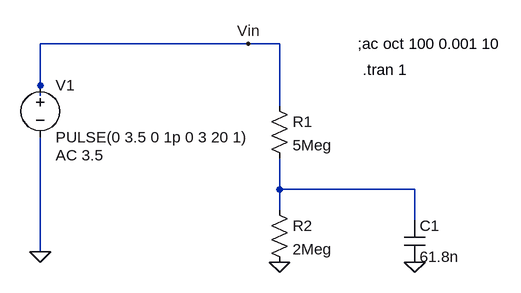
[diagram p0: schematic WeatherStationAnalogIn.asc]
WeatherStationAnalogIn.asc, the LTspice schematic file:
Version 4
SHEET 1 880 680
WIRE 80 0 -240 0
WIRE 128 0 80 0
WIRE -240 64 -240 0
WIRE -240 80 -240 64
WIRE 128 96 128 0
WIRE 128 224 128 176
WIRE 336 224 128 224
WIRE 128 256 128 224
WIRE 336 272 336 224
WIRE -240 320 -240 144
FLAG 80 0 Vin
FLAG 128 336 0
FLAG 336 336 0
FLAG -240 320 0
SYMBOL res 112 80 R0
SYMATTR InstName R1
SYMATTR Value 5Meg
SYMBOL res 112 240 R0
SYMATTR InstName R2
SYMATTR Value 2Meg
SYMBOL cap 320 272 R0
SYMATTR InstName C1
SYMATTR Value 61.8n
SYMBOL voltage -240 48 R0
WINDOW 123 24 124 Left 2
WINDOW 39 0 0 Left 2
SYMATTR InstName V1
SYMATTR Value PULSE(0 3.5 0 1p 0 3 20 1)
SYMATTR Value2 AC 3.5
TEXT 248 0 Left 2 !;ac oct 100 0.001 10
TEXT 256 40 Left 2 !.tran 1

The netlist it stands for:
* WeatherStationAnalogIn.asc
R1 Vin N001 5Meg
R2 N001 0 2Meg
C1 N001 0 61.8n
V1 Vin 0 PULSE(0 3.5 0 1p 0 3 20 1) AC 3.5
;ac oct 100 0.001 10
.tran 1
.backanno
.end